# Altium project WK_核心底板_v1_20250228.PrjPcb (part 2 of 2)

## Sheet POWER.SchDoc
size A3; SheetNumber: 17; SheetTotal: 17
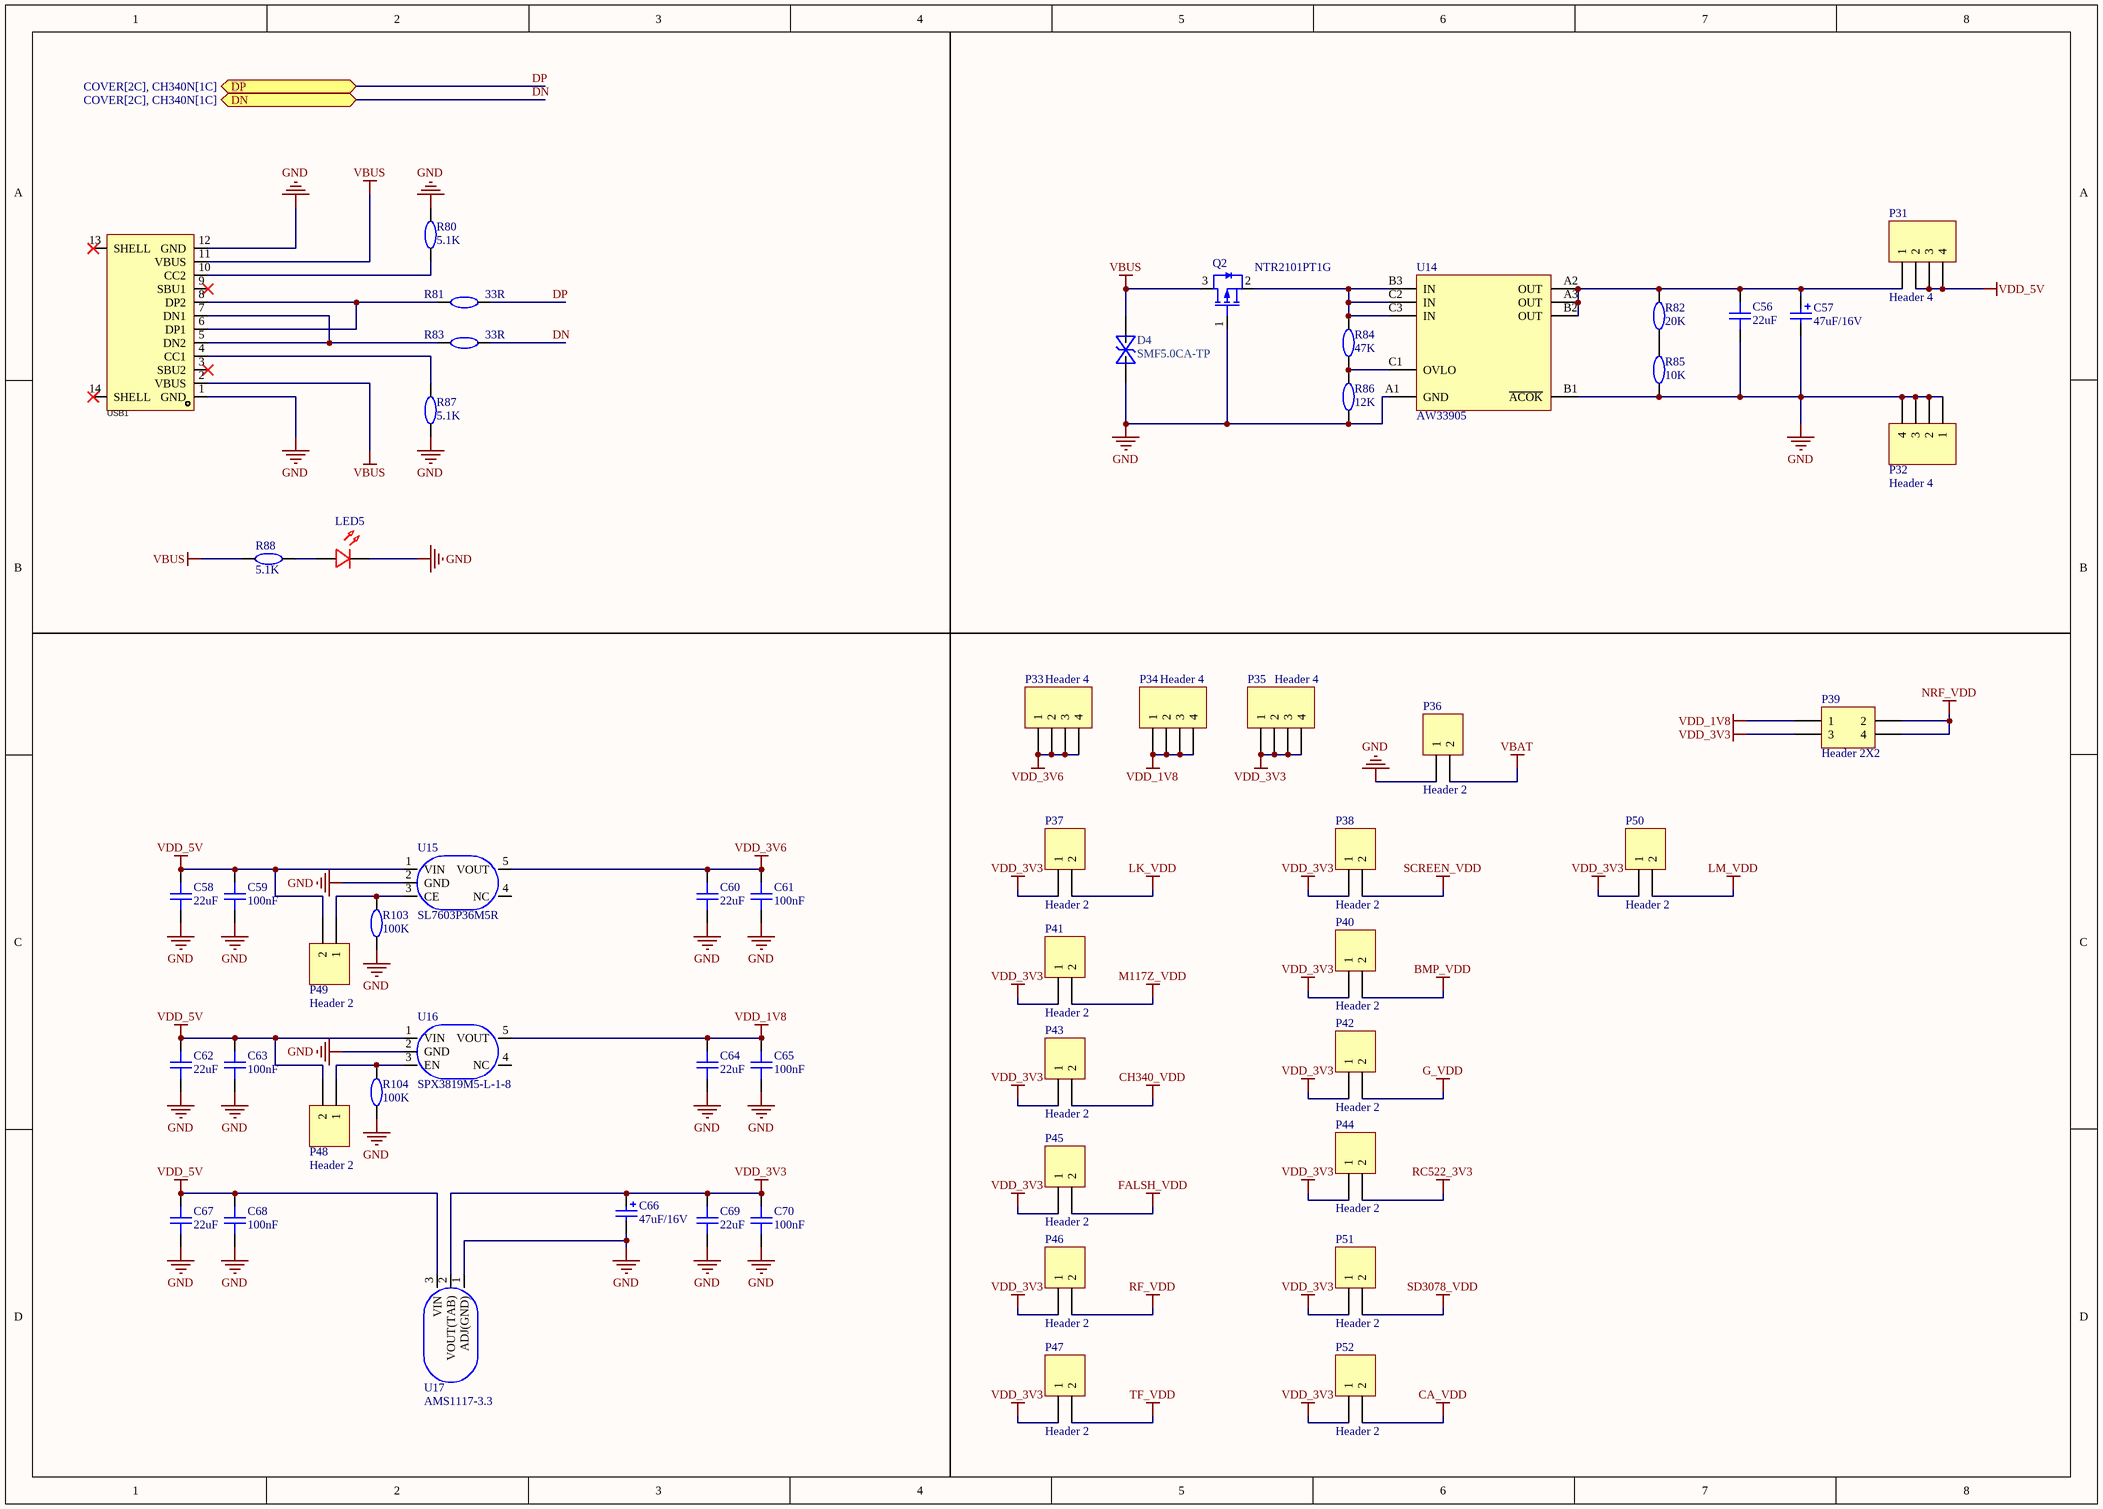
[diagram p16: POWER.SchDoc]

### Parts
C56  22uF  [C0603]
C57  47uF/16V  [CASE-B_3528]
C58  22uF  [C0603]
C59  100nF  [C0402]
C60  22uF  [C0603]
C61  100nF  [C0402]
C62  22uF  [C0603]
C63  100nF  [C0402]
C64  22uF  [C0603]
C65  100nF  [C0402]
C66  47uF/16V  [CASE-B_3528]
C67  22uF  [C0603]
C68  100nF  [C0402]
C69  22uF  [C0603]
C70  100nF  [C0402]
D4  SMF5.0CA-TP  [SOD-123FL_L2.8-W1.7-LS3.6]
LED5  LED_0603-R  [LED_0603]  (value not drawn)
P31  Header 4  [HDR1X4]
P32  Header 4  [HDR1X4]
P33  Header 4  [HDR1X4]
P34  Header 4  [HDR1X4]
P35  Header 4  [HDR1X4]
P36  Header 2  [HDR1X2]
P37  Header 2  [HDR1X2]
P38  Header 2  [HDR1X2]
P39  Header 2X2  [HDR2X2]
P40  Header 2  [HDR1X2]
P41  Header 2  [HDR1X2]
P42  Header 2  [HDR1X2]
P43  Header 2  [HDR1X2]
P44  Header 2  [HDR1X2]
P45  Header 2  [HDR1X2]
P46  Header 2  [HDR1X2]
P47  Header 2  [HDR1X2]
P48  Header 2  [HDR1X2]
P49  Header 2  [HDR1X2]
P50  Header 2  [HDR1X2]
P51  Header 2  [HDR1X2]
P52  Header 2  [HDR1X2]
Q2  NTR2101PT1G  [SOT-23(SOT-23-3)]
R80  5.1K  [R0402]
R81  33R  [R0402]
R82  20K  [R0402]
R83  33R  [R0402]
R84  47K  [R0402]
R85  10K  [R0402]
R86  12K  [R0402]
R87  5.1K  [R0402]
R88  5.1K  [R0402]
R103  100K  [R0402]
R104  100K  [R0402]
U14  AW33905  [DSBGA-9_L1.2-W1.2-R3-C3-P0.40-BL]
U15  SL7603P36M5R  [SOT-23-5_L3.0-W1.7-P0.95-LS2.8-BL]
U16  SPX3819M5-L-1-8  [SOT-23-5_L3.0-W1.7-P0.95-LS2.8-BL]
U17  AMS1117-3.3  [SOT-89_L4.5-W2.5-P1.50-LS4.2-BR]
USB1  TYPE-C 16PIN 2MD(073)  [USB-C-SMD_TYPE-C-6PIN-2MD-073]  (value not drawn)

### Ports
DN (bidir, see COVER[2C], CH340N[1C]), DP (bidir, see COVER[2C], CH340N[1C])

### Nets
BMP_VDD: P40.2
CA_VDD: P52.2
CH340_VDD: P43.2
FALSH_VDD: P45.2
G_VDD: P42.2
GND: C56.1 C57.2 C58.1 C59.1 C60.1 C61.1 C62.1 C63.1 C64.1 C65.1 C66.2 C67.1 C68.1 C69.1 C70.1 D4.1 LED5.1(C) P32.1 P32.2 P32.3 P32.4 P36.1 Q2.1(G) R80.2 R85.1 R86.1 R87.1 R103.1 R104.1 U14.A1(GND) U14.B1(~{ACOK}) U15.2(GND) U16.2(GND) U17.1(ADJ(GND)) USB1.1(GND) USB1.12(GND)
LK_VDD: P37.2
LM_VDD: P50.2
M117Z_VDD: P41.2
NRF_VDD: P39.2 P39.4
RC522_3V3: P44.2
RF_VDD: P46.2
SCREEN_VDD: P38.2
SD3078_VDD: P51.2
TF_VDD: P47.2
VBAT: P36.2
VBUS: D4.2 Q2.3(D) R88.2 USB1.2(VBUS) USB1.11(VBUS)
VDD_1V8: C64.2 C65.2 P34.1 P34.2 P34.3 P34.4 P39.1 U16.5(VOUT)
VDD_3V3: C66.1 C69.2 C70.2 P35.1 P35.2 P35.3 P35.4 P37.1 P38.1 P39.3 P40.1 P41.1 P42.1 P43.1 P44.1 P45.1 P46.1 P47.1 P50.1 P51.1 P52.1 U17.2(VOUT(TAB))
VDD_3V6: C60.2 C61.2 P33.1 P33.2 P33.3 P33.4 U15.5(VOUT)
VDD_5V: C58.2 C59.2 C62.2 C63.2 C67.2 C68.2 P31.2 P31.3 P31.4 P48.2 P49.2 U15.1(VIN) U16.1(VIN) U17.3(VIN)
DN: R83.1 ; port DN
DP: R81.1 ; port DP
NetC56_2: C56.2 C57.1 P31.1 R82.2 U14.A2(OUT) U14.A3(OUT) U14.B2(OUT)
NetLED5_2: LED5.2(A) R88.1
NetP48_1: P48.1 R104.2 U16.3(EN)
NetP49_1: P49.1 R103.2 U15.3(CE)
NetQ2_2: Q2.2(S) R84.2 U14.B3(IN) U14.C2(IN) U14.C3(IN)
NetR80_1: R80.1 USB1.10(CC2)
NetR81_2: R81.2 USB1.6(DP1) USB1.8(DP2)
NetR82_1: R82.1 R85.2
NetR83_2: R83.2 USB1.5(DN2) USB1.7(DN1)
NetR84_1: R84.1 R86.2 U14.C1(OVLO)
NetR87_2: R87.2 USB1.4(CC1)

Not connected (* = marked no-connect by the designer): U15 4(NC); U16 4(NC); USB1 3(SBU2)* 9(SBU1)* 13(SHELL)* 14(SHELL)*

### Library data of the parts
C56 C58 C60 C62 C64 C67 C69 = CAP_0603: Symbol: CapAcitance; Convert to PCB: yes; Device: CAP_0603; Add into BOM: yes; Supplier Footprint: 0603; Value: 22uF; Name: 22uF
C57 C66 = Cap_CASE_B_3528: J  Polarized Capacitor 有极性电容; Published: 8-Jun-2000; LatestRevisionDate: 17-Jul-2002; LatestRevisionNote: Re-released for DXP Platform.; PackageReference: RB7.6-15; Publisher: Altium Limited
C59 C61 C63 C65 C68 C70 = CAP_0402: Symbol: CapAcitance; Device: CAP_0603; Convert to PCB: yes; Add into BOM: yes; Supplier Footprint: 0603; Value: 100nF; Name: 100nF
D4 = SMF5.0CA-TP: C914432; Manufacturer: MCC(美微科); Add into BOM: yes; Reverse Stand-Off Voltage (Vrwm): 5V; Breakdown Voltage: 6.4V; Maximum Clamping Voltage: 9.2V; Peak Pulse Power Dissipation (Ppp)@10/1000μs: 200W; Name: SMF5.0CA-TP; Symbol: SMF5.0CA-TP; Device: SMF5.0CA-TP; LCSC Part Name: Vrwm:5V 200W; Supplier Part: C914432; Manufacturer Part: SMF5.0CA-TP; Supplier Footprint: SOD-123FL; JLCPCB Part Class: Extended Part; Supplier: LCSC; Convert to PCB: yes; Peak Pulse Current (Ipp)@10/1000μs: -
LED5 = LED_0603-R: Symbol: LED_R; Convert to PCB: yes; Device: LED_0603-R; Add into BOM: yes; Supplier Footprint: 0603
P31-P35 = Header 4: Header, 4-Pin; LatestRevisionDate: 17-Jul-2002; LatestRevisionNote: Re-released for DXP Platform.; Publisher: Altium Limited
P36-P38 P40-P52 = Header 2: Header, 2-Pin; LatestRevisionDate: 17-Jul-2002; LatestRevisionNote: Re-released for DXP Platform.; Publisher: Altium Limited
P39 = Header 2X2: Header, 2-Pin, Dual row; LatestRevisionDate: 17-Jul-2002; LatestRevisionNote: Re-released for DXP Platform.; Publisher: Altium Limited
Q2 = NTR2101PT1G: J  MOS(场效应管)P道沟  二极管 C168745; ComponentLink1Description: 供应商链接; ComponentLink1URL: http://www.szlcsc.com/product/details_15801.html; Package: SOT-23; Supplier: LC; SuppliersPartNumber: C15127
R80-R88 R103 R104 = Res_0402: Symbol: 电阻; Device: Res_0603; Convert to PCB: yes; Add into BOM: yes; Supplier Footprint: 0603
  R80 R87 R88: Value: 5.1K; Name: 5.1K
  R81 R83: Value: 33R; Name: 33R
  R82: Value: 20K; Name: 20K
  R84: Value: 47K; Name: 47K
  R85: Value: 10K; Name: 10K
  R86: Value: 12K; Name: 12K
  R103 R104: Value: 100K; Name: 100K
U14 = AW33905: C401024
U15 = SL7603P36M5R: Manufacturer: Slkor(萨科微); Add into BOM: yes; Output Type: 固定; Voltage - Supply: 15V; Output Voltage: 3.6V; Output Current: 500mA; Power Supply Rejection Ratio (PSRR): 40dB@(1kHz); standby current: 1.5uA; Output Configuration: 正极; Number of Outputs: 1; Symbol: SL7603P36M5R; Device: SL7603P36M5R; LCSC Part Name: SL7603P36M5R; Supplier Part: C2980848; Manufacturer Part: SL7603P36M5R; Supplier Footprint: SOT-23-5; JLCPCB Part Class: 扩展库; Datasheet: https://atta.szlcsc.com/upload/public/pdf/source/20220307/518C601A763BD9CEA6771D5C37F92E89.pdf; Supplier: LCSC; Convert to PCB: yes; Voltage Dropout: -; Features: 过流保护(OCP); Operating Temperature: -40℃~+85℃; Name: SL7603P36M5R
U16 = SPX3819M5-L-1-8: Manufacturer: TECH PUBLIC(台舟); Symbol: SPX3819M5-L-1-8_C20617308; Add into BOM: yes; Output Type: 固定; Voltage - Supply: 20V; Output Voltage: 1.8V; Output Current: 500mA; Power Supply Rejection Ratio (PSRR): 70dB@(1kHz); Output Configuration: 正极; Number of Outputs: 1; Device: SPX3819M5-L-1-8; LCSC Part Name: 线性稳压器(LDO); Supplier Part: C20617308; Manufacturer Part: SPX3819M5-L-1-8; Supplier Footprint: SOT-23-5; JLCPCB Part Class: 扩展库; Datasheet: https://atta.szlcsc.com/upload/public/pdf/source/20240202/7EEEDAA3825A922ACCB947122BCA4C1B.pdf; Supplier: LCSC; Convert to PCB: yes; Operating Temperature: -40℃~+125℃@(Tj); Name: SPX3819M5-L-1-8
U17 = AMS1117-3.3_C347256: Manufacturer: UMW(友台半导体); Add into BOM: yes; Output Type: 固定; Voltage - Supply: 18V; Output Voltage: 3.3V; Output Current: 1A; Power Supply Rejection Ratio (PSRR): 60dB@(120Hz); Voltage Dropout: 1.3V@(1A); Output Configuration: 正极; Number of Outputs: 1; Symbol: AMS1117-3.3_C347256; Device: AMS1117-3.3_C347256; LCSC Part Name: 输出:3.3V 电流:1A 耐压:18V; Supplier Part: C347256; Manufacturer Part: AMS1117-3.3; Supplier Footprint: SOT-89; JLCPCB Part Class: 扩展库; Datasheet: https://atta.szlcsc.com/upload/public/pdf/source/20241218/BAF0263FA2E44BCD8AF41AA4FA04EFAA.pdf; Supplier: LCSC; Convert to PCB: yes; standby current: -; Noise: -; Features: 过流保护; Operating Temperature: -; Name: AMS1117-3.3
USB1 = TYPE-C 16PIN 2MD(073): C2765186; Manufacturer: SHOU HAN(首韩); Add into BOM: yes; Gender: 母; Number of Ports: 1; Number of Contacts: 16P; Current Rating - Power (Max): 5A; Symbol: TYPE-C 16PIN 2MD(073); Device: TYPE-C 16PIN 2MD(073); Supplier: LCSC; Supplier Part: C2765186; Manufacturer Part: TYPE-C 16PIN 2MD(073); JLCPCB Part Class: Extended Part; LCSC Part Name: Type-C 母 卧贴; Supplier Footprint: SMD; Datasheet: https://atta.szlcsc.com/upload/public/pdf/source/20211123/39B17C16241EAC15C5E277BDA434118E.pdf; Convert to PCB: yes; Connector Type: Type-C; Standard: -; Mounting Style: 卧贴; Operating Temperature Range: -25℃~+85℃

## Sheet LM2903+CAT5171TBI.SchDoc
size A4; SheetNumber: 14; SheetTotal: 17
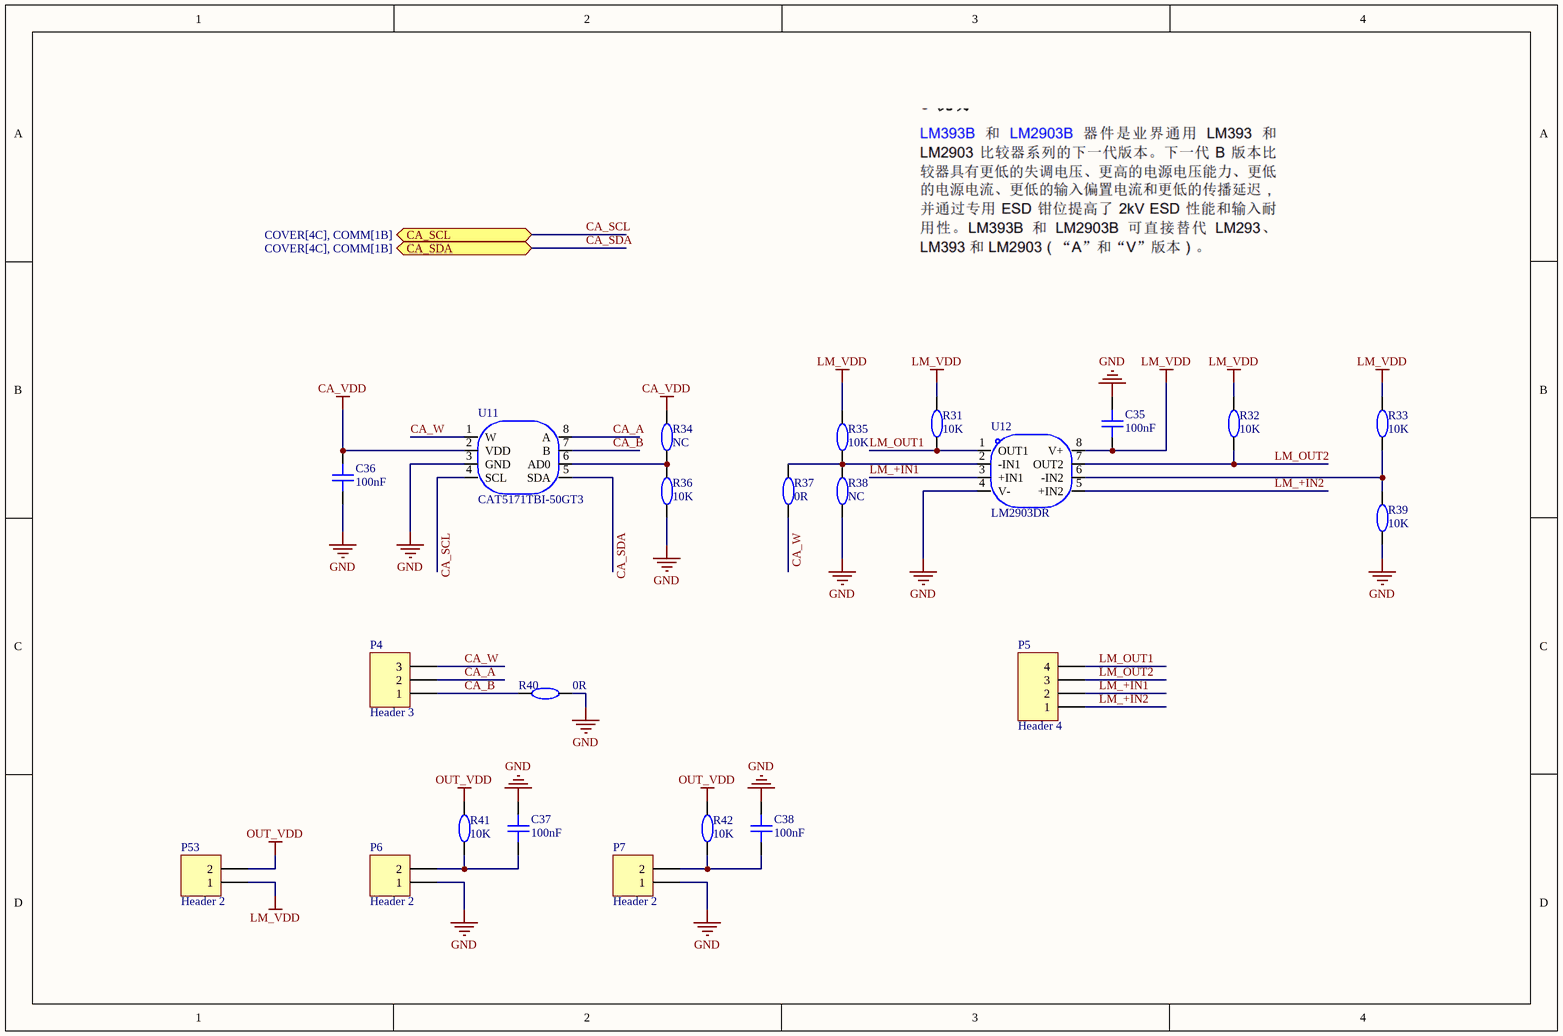
[diagram p17: LM2903+CAT5171TBI.SchDoc]

### Parts
C35  100nF  [C0402]
C36  100nF  [C0402]
C37  100nF  [C0402]
C38  100nF  [C0402]
P4  Header 3  [HDR1X3]
P5  Header 4  [HDR1X4]
P6  Header 2  [HDR1X2]
P7  Header 2  [HDR1X2]
P53  Header 2  [HDR1X2]
R31  10K  [R0402]
R32  10K  [R0402]
R33  10K  [R0603]
R34  NC  [R0402]
R35  10K  [R0603]
R36  10K  [R0402]
R37  0R  [R0603]
R38  NC  [R0603]
R39  10K  [R0603]
R40  0R  [R0603]
R41  10K  [R0402]
R42  10K  [R0402]
U11  CAT5171TBI-50GT3  [SOT-23-8_L3.0-W1.7-P0.65-LS2.8-BR]
U12  LM2903DR  [SOIC-8_L5.0-W4.0-P1.27-LS6.0-BL]

### Ports
CA_SCL (bidir, see COVER[4C], COMM[1B]), CA_SDA (bidir, see COVER[4C], COMM[1B])

### Nets
CA_VDD: C36.2 R34.2 U11.2(VDD)
GND: C35.2 C36.1 C37.2 C38.2 P6.1 P7.1 R36.1 R38.1 R39.1 R40.1 U11.3(GND) U12.4(V-)
LM_VDD: C35.1 P53.1 R31.2 R32.2 R33.2 R35.2 U12.8(V+)
OUT_VDD: P53.2 R41.2 R42.2
CA_A: P4.2 U11.8(A)
CA_B: P4.1 R40.2 U11.7(B)
CA_SCL: U11.4(SCL) ; port CA_SCL
CA_SDA: U11.5(SDA) ; port CA_SDA
CA_W: P4.3 R37.1 U11.1(W)
LM_+IN1: P5.2 U12.3(+IN1)
LM_+IN2: P5.1 U12.5(+IN2)
LM_OUT1: P5.4 R31.1 U12.1(OUT1)
LM_OUT2: P5.3 R32.1 U12.7(OUT2)
NetC37_1: C37.1 P6.2 R41.1
NetC38_1: C38.1 P7.2 R42.1
NetR33_1: R33.1 R39.2 U12.6(-IN2)
NetR34_1: R34.1 R36.2 U11.6(AD0)
NetR35_1: R35.1 R37.2 R38.2 U12.2(-IN1)

### Library data of the parts
C35-C38 = CAP_0402: as C59 on sheet POWER; Add into BOM: yes; Supplier Footprint: 0603; Value: 100nF; Name: 100nF
P4 = Header 3: Header, 3-Pin; LatestRevisionDate: 17-Jul-2002; LatestRevisionNote: Re-released for DXP Platform.; Publisher: Altium Limited
P5 = Header 4: Header, 4-Pin; LatestRevisionDate: 17-Jul-2002; LatestRevisionNote: Re-released for DXP Platform.; Publisher: Altium Limited
P6 P7 P53 = Header 2: Header, 2-Pin; LatestRevisionDate: 17-Jul-2002; LatestRevisionNote: Re-released for DXP Platform.; Publisher: Altium Limited
R31 R32 R34 R36 R41 R42 = Res_0402: as R80 on sheet POWER; Add into BOM: yes; Supplier Footprint: 0603
  R31 R32 R36 R41 R42: Value: 10K; Name: 10K
  R34: Value: NC; Name: NC
R33 R35 R37-R40 = Res_0603: Symbol: 电阻; Convert to PCB: yes; Device: Res_0603; Add into BOM: yes; Supplier Footprint: 0603
  R33 R35 R39: Value: 10K; Name: 10K
  R37 R40: Value: 0R; Name: 0R
  R38: Value: NC; Name: NC
U11 = CAT5171TBI-50GT3: Manufacturer: onsemi(安森美); Add into BOM: yes; Resistance Value (Ohms): 50kΩ; Number of Taps: 256; Number of Channels: 1; Tolerance: ±20%; Voltage - Supply: 2.7V~5.5V; Interface: I2C; Temperature Coefficient(Typ): ±100ppm/℃; Symbol: CAT5171TBI-50GT3; Device: CAT5171TBI-50GT3; LCSC Part Name: CAT5171TBI-50GT3; Supplier Part: C154777; Manufacturer Part: CAT5171TBI-50GT3; Supplier Footprint: SOT-23-8; JLCPCB Part Class: 扩展库; Datasheet: https://atta.szlcsc.com/upload/public/pdf/source/20180112/C154777_15157258174431261651.PDF; Supplier: LCSC; Convert to PCB: yes; Operating Temperature: -40℃~+85℃; Name: CAT5171TBI-50GT3
U12 = LM2903DR: Manufacturer: TI(德州仪器); Symbol: LM2903DRG4; Add into BOM: yes; Input Offset Voltage (Vos): 7mV; Input Bias Current (Ib): 250nA; Supply Voltage: 1V~18V；2V~36V; Output Type: 开集; Supply Current: 2.5mA; Device: LM2903DR; LCSC Part Name: 双路差分比较器; Supplier Part: C7549; Manufacturer Part: LM2903DR; Supplier Footprint: SOIC-8; JLCPCB Part Class: 扩展库; Datasheet: https://www.ti.com/cn/lit/gpn/lm293; Supplier: LCSC; Convert to PCB: yes; Input Hysteresis Voltage (Vhys): -; Common Mode Rejection Ratio (CMRR): -; Output Mode: -; Operating Temperature: -40℃~+125℃; Name: LM2903DR

## Nets that join several sheets
BMP_VDD: BMP581 (5 pins), POWER (P40.2)
CA_VDD: POWER (P52.2), LM2903+CAT5171TBI (C36.2 R34.2 U11.2)
CH340_VDD: CH340N (C7.2 R9.2 U2.5), POWER (P43.2)
FALSH_VDD: W25Q128 (C9.1 R10.2 R11.2 U4.8), POWER (P45.2)
G_VDD: LSM6DS3TR-C (5 pins), POWER (P42.2)
GND: LED+KEY (8 pins), M117Z (C5.1 R19.1 U1.2), CH340N (C6.2 C7.1 U2.3), MAX17048 (5 pins), W25Q128 (C9.2 U4.4 U4.9), RF2401 (30 pins), TF (8 pins), PAM8302A (C23.2 C24.2 P2.5 U6.7), SCREEN (28 pins), BMP581 (6 pins), LSM6DS3TR-C (7 pins), SD3078 (5 pins), RC522 (28 pins), COMM (5 pins), POWER (36 pins), LM2903+CAT5171TBI (12 pins)
LK_VDD: LED+KEY (8 pins), POWER (P37.2)
LM_VDD: POWER (P50.2), LM2903+CAT5171TBI (7 pins)
M117Z_VDD: M117Z (C5.2 U1.5), POWER (P41.2)
NRF_VDD: MAX17048 (R20.1), COMM (7 pins), POWER (P39.2 P39.4)
RC522_3V3: RC522 (9 pins), POWER (P44.2)
RF_VDD: RF2401 (C10.2 C11.2 C12.2 U5.16), POWER (P46.2)
SCREEN_VDD: SCREEN (11 pins), POWER (P38.2)
SD3078_VDD: SD3078 (C34.2 R29.2 R30.1 U10.3), POWER (P51.2)
TF_VDD: TF (5 pins), POWER (P47.2)
VBAT: MAX17048 (U3.3), POWER (P36.2)
CA_SCL: COMM (R78.1), LM2903+CAT5171TBI (U11.4)
CA_SDA: COMM (R79.1), LM2903+CAT5171TBI (U11.5)
CTP_INT: SCREEN (FPC2.3 R99.2), COMM (P10.4)
CTP_RST: SCREEN (FPC2.2), COMM (P10.2)
CTP_SCL: SCREEN (FPC2.5), COMM (R101.1)
CTP_SDA: SCREEN (FPC2.4), COMM (R102.1)
DN: CH340N (U2.2), POWER (R83.1)
DP: CH340N (U2.1), POWER (R81.1)
FLASH_CLK: W25Q128 (U4.6), COMM (R71.1)
FLASH_CS: W25Q128 (U4.1), COMM (P30.1)
FLASH_HOLD/IO3: W25Q128 (R11.1 U4.7), COMM (P29.1)
FLASH_MISO: W25Q128 (U4.2), COMM (R75.1)
FLASH_MOSI: W25Q128 (U4.5), COMM (R73.1)
FLASH_WP/IO2: W25Q128 (R10.1 U4.3), COMM (P28.1)
G_INT: LSM6DS3TR-C (U8.4), COMM (P10.11)
G_SCL: LSM6DS3TR-C (U8.13), COMM (R64.1)
G_SDA: LSM6DS3TR-C (U8.14), COMM (R66.1)
KEY1: LED+KEY (C1.2 R1.1 SW1.2), COMM (P19.1)
KEY2: LED+KEY (C2.2 R2.1 SW2.2), COMM (P20.1)
KEY3: LED+KEY (C3.2 R3.1 SW3.2), COMM (P21.1)
KEY4: LED+KEY (C4.2 R4.1 SW4.2), COMM (P22.1)
LED1: LED+KEY (LED1.1), COMM (P13.1)
LED2: LED+KEY (LED2.1), COMM (P14.1)
LED3: LED+KEY (LED3.1), COMM (P15.1)
LED4: LED+KEY (LED4.1), COMM (P16.1)
M117Z_AL: M117Z (R19.2 U1.3), COMM (P10.5)
M117Z_SCL: M117Z (U1.1), COMM (R57.1)
M117Z_SDA: M117Z (U1.6), COMM (R58.1)
MAX17048_AL: MAX17048 (R20.2 U3.5), COMM (P10.3)
MAX17048_SCL: MAX17048 (U3.7), COMM (R60.1)
MAX17048_SDA: MAX17048 (U3.8), COMM (R62.1)
P_INT: BMP581 (U7.7), COMM (P10.9)
P_SCL: BMP581 (U7.2), COMM (R76.1)
P_SDA: BMP581 (U7.4), COMM (R77.1)
RC522_IRQ: RC522 (U13.23), COMM (P10.15)
RC522_RST: RC522 (R100.2 U13.6), COMM (P10.13)
RC522_SCL: RC522 (U13.31), COMM (R72.1)
RC522_SDA: RC522 (U13.24), COMM (R74.1)
RXD: CH340N (U2.7), COMM (P17.1)
SCREEN_BLK: SCREEN (Q1.1), COMM (P10.12)
SCREEN_CLK: SCREEN (FPC1.10), COMM (R65.1)
SCREEN_CS: SCREEN (FPC1.9), COMM (P10.8)
SCREEN_DC: SCREEN (FPC1.11), COMM (P10.10)
SCREEN_MISO: SCREEN (FPC1.14), COMM (R69.1)
SCREEN_MOSI: SCREEN (FPC1.13), COMM (R67.1)
SCREEN_RST: SCREEN (FPC1.15 R92.2), COMM (P10.6)
SD3078_INT: SD3078 (R30.2 U10.7), COMM (P10.7)
SD3078_SCL: SD3078 (U10.1), COMM (R68.1)
SD3078_SDA: SD3078 (U10.8), COMM (R70.1)
TF_CD: TF (CARD1.9 R18.2), COMM (P10.14)
TF_CLK: TF (CARD1.5 D1.1), COMM (R59.1)
TF_CS: TF (CARD1.2 D3.5), COMM (P10.16)
TF_MISO: TF (CARD1.7 D3.3), COMM (R63.1)
TF_MOSI: TF (CARD1.3 D2.1), COMM (R61.1)
TXD: CH340N (U2.6), COMM (P18.1)